# EAGLE schematic serre light v2 (EAGLE 9.3.0)
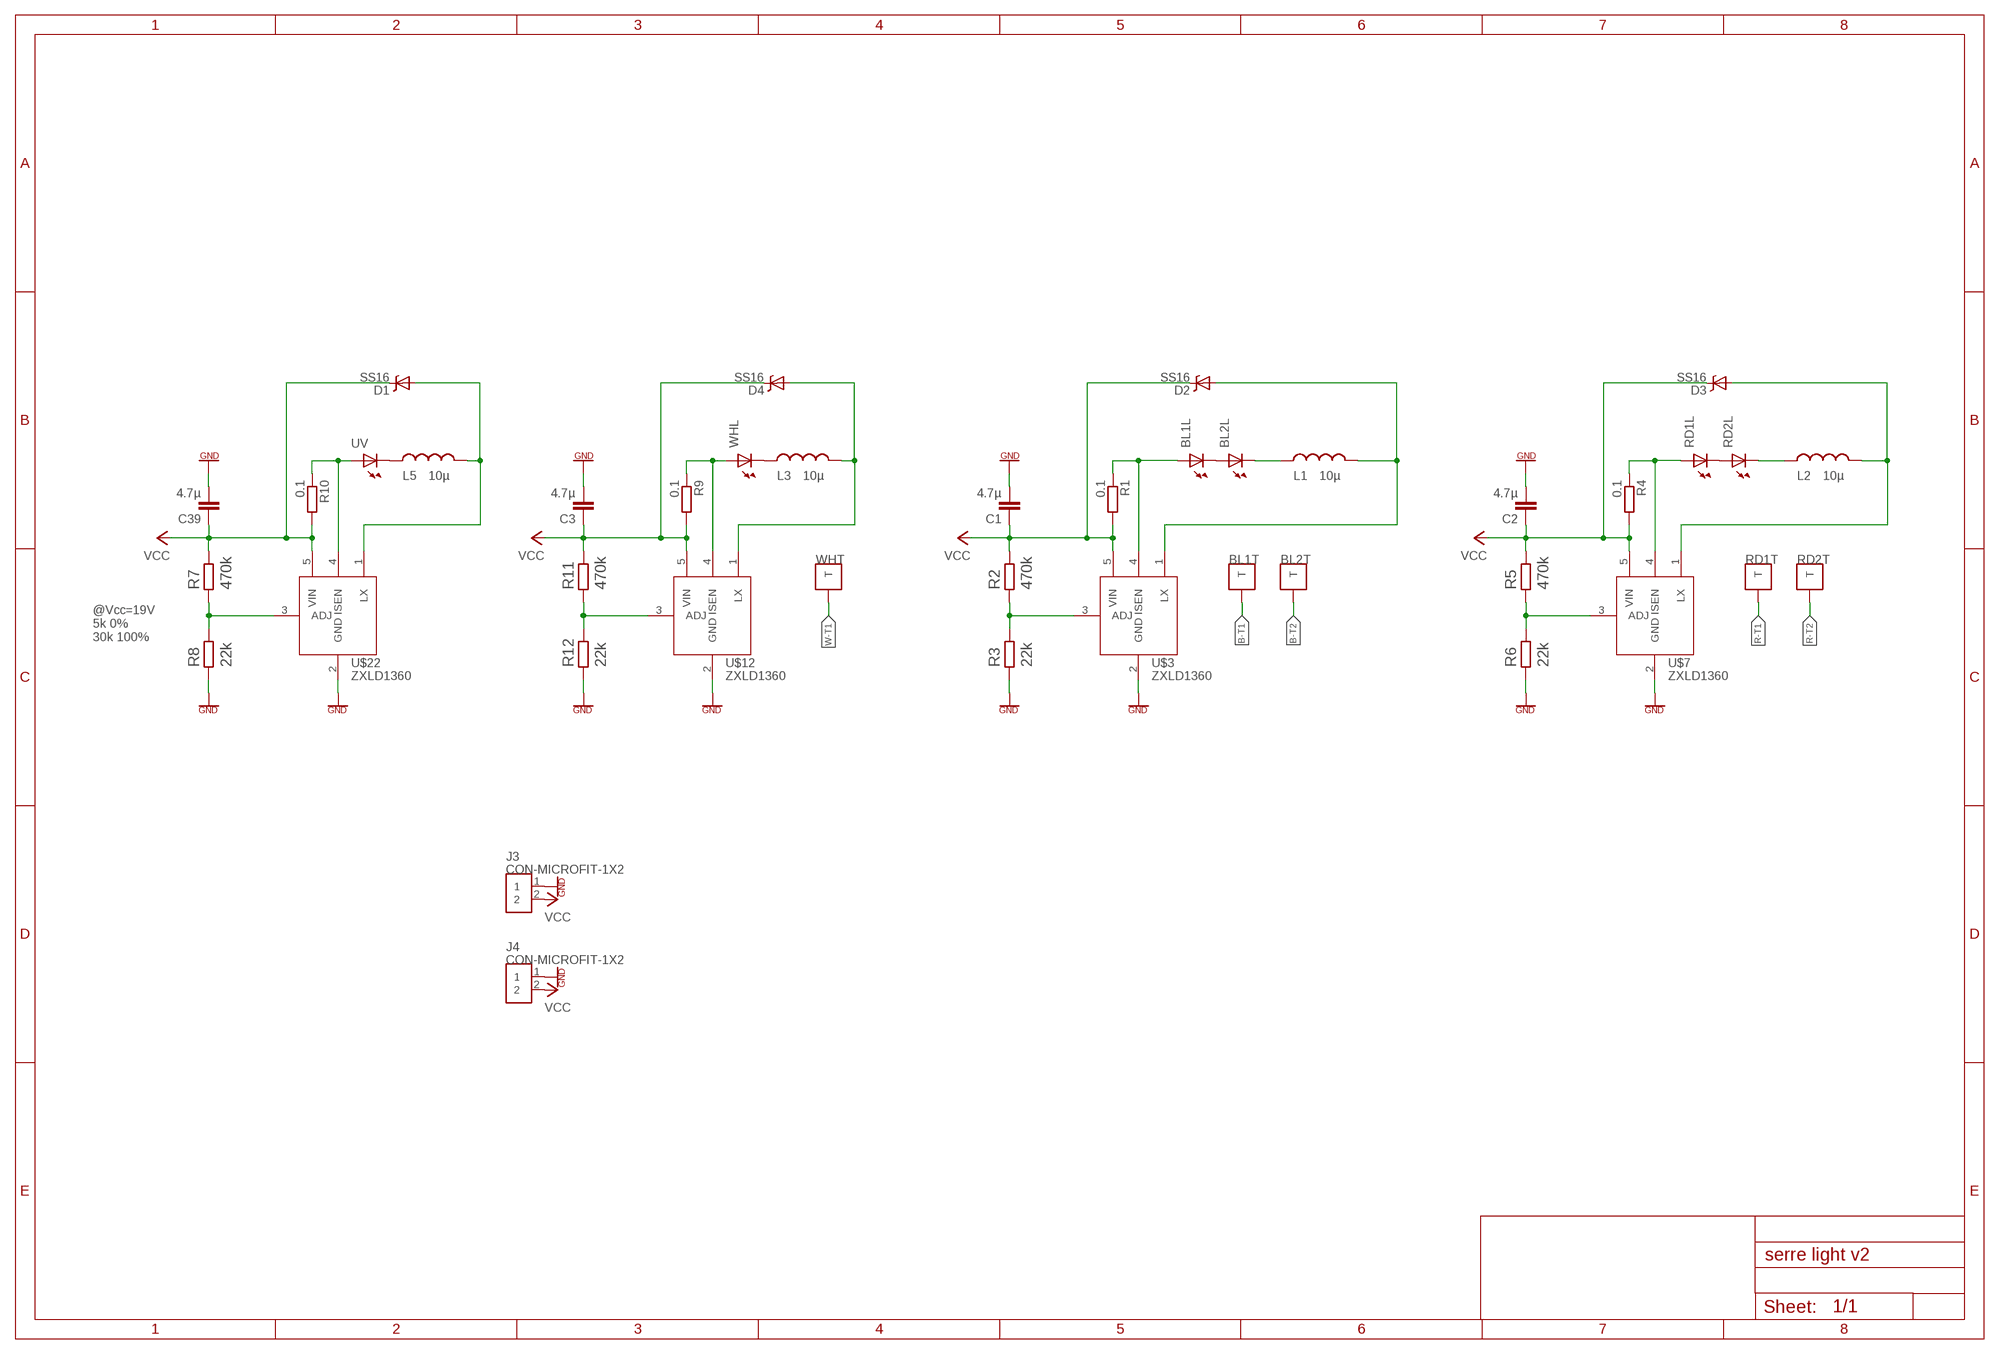
[diagram p0: schematic, sheet 1]

## Parts
BL1  LED-THERMAL-CREE-GP-G3  [LED-CREE-GP-G3]
BL2  LED-THERMAL-CREE-GP-G3  [LED-CREE-GP-G3]
C1  4.7µ  C-EUC1210  [C1210]
C2  4.7µ  C-EUC1210  [C1210]
C3  4.7µ  C-EUC1210  [C1210]
C39  4.7µ  C-EUC1210  [C1210]
D1  SS16  DIODE_SCHOTTKY_SS16  [SS16_DIODE]
D2  SS16  DIODE_SCHOTTKY_SS16  [SS16_DIODE]
D3  SS16  DIODE_SCHOTTKY_SS16  [SS16_DIODE]
D4  SS16  DIODE_SCHOTTKY_SS16  [SS16_DIODE]
J3  CON-MICROFIT-1X2  [MICROFIT-1X2]
J4  CON-MICROFIT-1X2  [MICROFIT-1X2]
L1  10µ  LSRN5040TA  [SRN5040TA]
L2  10µ  LSRN5040TA  [SRN5040TA]
L3  10µ  LSRN5040TA  [SRN5040TA]
L5  10µ  LSRN5040TA  [SRN5040TA]
R1  0.1  R-EU_R1206  [R1206]
R2  470k  R0805  [R0805]
R3  22k  R0805  [R0805]
R4  0.1  R-EU_R1206  [R1206]
R5  470k  R0805  [R0805]
R6  22k  R0805  [R0805]
R7  470k  R0805  [R0805]
R8  22k  R0805  [R0805]
R9  0.1  R-EU_R1206  [R1206]
R10  0.1  R-EU_R1206  [R1206]
R11  470k  R0805  [R0805]
R12  22k  R0805  [R0805]
RD1  LED-THERMAL-LUMINU-SST-10-DR  [LED-LUMINU-SST-10-DR]
RD2  LED-THERMAL-LUMINU-SST-10-DR  [LED-LUMINU-SST-10-DR]
U$3  ZXLD1360  [SOT23-5L]
U$7  ZXLD1360  [SOT23-5L]
U$12  ZXLD1360  [SOT23-5L]
U$22  ZXLD1360  [SOT23-5L]
UV  LED-LUXEON-UV-U2  [LED-LUXEON-UV-U2]
WH  LED-THERMAL-OSRAM-GW  [LED-OSRAM-GW]

## Nets
B-T1: BL1.THERMAL(T:T)
B-T2: BL2.THERMAL(T:T)
GND: C1.2 C2.2 C3.2 C39.2 J3.1 J4.1 R3.1 R6.1 R8.1 R12.1 U$3.2(GND) U$7.2(GND) U$12.2(GND) U$22.2(GND)
N$2: BL1.C(L:C) BL2.A(L:A)
N$3: R2.1 R3.2 U$3.3(ADJ)
N$4: BL1.A(L:A) R1.1 U$3.4(ISEN)
N$5: RD1.C(L:C) RD2.A(L:A)
N$7: BL2.C(L:C) L1.P$1
N$8: D2.A L1.P$2 U$3.1(LX)
N$9: R5.1 R6.2 U$7.3(ADJ)
N$10: R4.1 RD1.A(L:A) U$7.4(ISEN)
N$11: L2.P$1 RD2.C(L:C)
N$12: D3.A L2.P$2 U$7.1(LX)
N$13: R11.1 R12.2 U$12.3(ADJ)
N$14: R9.1 U$12.4(ISEN) WH.A(L:A)
N$15: L3.P$1 WH.C(L:C)
N$17: D4.A L3.P$2 U$12.1(LX)
N$21: R7.1 R8.2 U$22.3(ADJ)
N$33: R10.1 U$22.4(ISEN) UV.A
N$35: L5.P$1 UV.C
N$36: D1.A L5.P$2 U$22.1(LX)
R-T1: RD1.THERMAL(T:T)
R-T2: RD2.THERMAL(T:T)
VCC: C1.1 C2.1 C3.1 C39.1 D1.K(C) D2.K(C) D3.K(C) D4.K(C) J3.2 J4.2 R1.2 R2.2 R4.2 R5.2 R7.2 R9.2 R10.2 R11.2 U$3.5(VIN) U$7.5(VIN) U$12.5(VIN) U$22.5(VIN)
W-T1: WH.THERMAL(T:T)

## Notes on the sheet
- @Vcc=19V
  5k 0%
  30k 100%

## Library data of the parts
BL1 BL2 = Bonelli:LED-THERMAL; MPN: XPGDRY-L1-0000-00601
C1-C3 C39 = rcl:C-EU: CAPACITOR, European symbol; SPICEPREFIX: C
D1-D4 = 0SBLib:DIODE_SCHOTTKY
J3 J4 = Bonelli:CON-MICROFIT-1X2; FAB: MOLEX; FAB-REF: 43650-0228; MOUSER: 538-43650-0228
L1-L3 L5 = 0SBLib:L; FARNELL: 2288225
R1 R4 R9 R10 = rcl:R-EU_: RESISTOR, European symbol; FARNELL: 1099913; SPICEPREFIX: R
R2 R3 R5-R8 R11 R12 = 0SBLib:R
RD1 RD2 = Bonelli:LED-THERMAL
U$3 U$7 U$12 U$22 = 0SBLib:ZXLD1360
UV = Bonelli:LED-*: 0603 Rouge : Farnell 1685073
WH = Bonelli:LED-THERMAL; MPN: GW CS8PM1.PM-LSLU-XX52-1